# EAGLE design esp32_wroom_wearable (EAGLE 9.6.2)

## Sheet 1 of 3
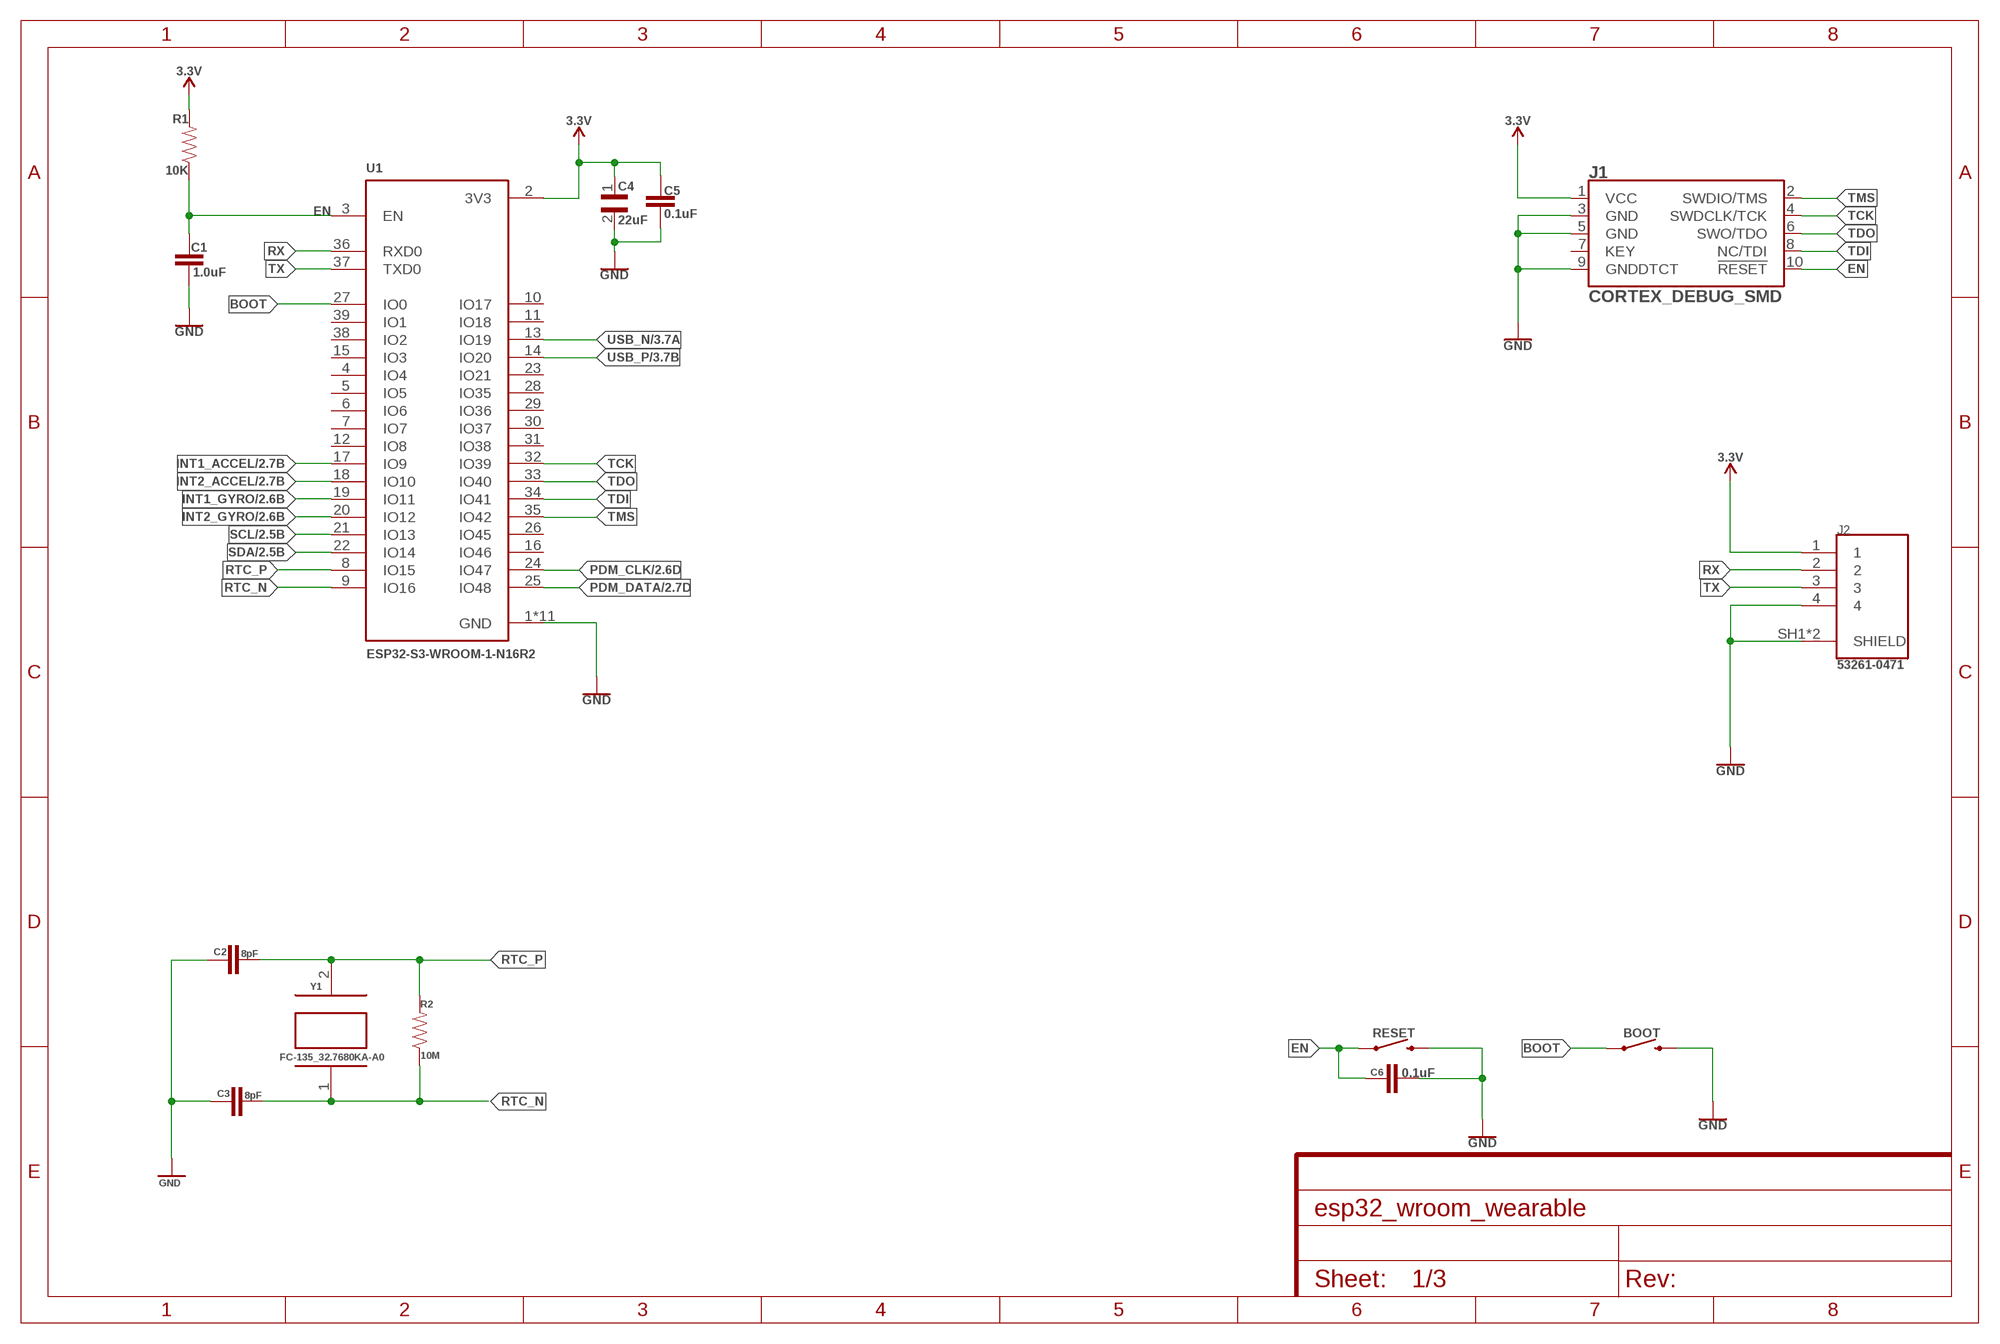
[diagram p0: schematic, sheet 1]

### Parts
BOOT  MOMENTARY-SWITCH-SPST-SMD-4.6X2.8MM  [TACTILE_SWITCH_SMD_4.6X2.8MM]
C1  1.0uF  1.0UF-0402-16V-10%  [0402]
C2  8pF  6PF-0402-50V-0.5%  [0402]
C3  8pF  6PF-0402-50V-0.5%  [0402]
C4  22uF  04026D226MAT2A  [CAPC1005X71N]
C5  0.1uF  0.1UF-0402-16V-10%  [0402]
C6  0.1uF  0.1UF-0402-16V-10%  [0402]
J1  CORTEX_DEBUG_SMD  [SAMTECH_FTSH-105-01]
J2  53261-0471  [MOLEX_53261-0471]
R1  10K  RESISTOR0402  [0402]
R2  10M  RESISTOR0402  [0402]
RESET  MOMENTARY-SWITCH-SPST-SMD-4.6X2.8MM  [TACTILE_SWITCH_SMD_4.6X2.8MM]
U1  ESP32-S3-WROOM-1-N16R2  [XCVR_ESP32-S3-WROOM-1-N16R2]
Y1  FC-135_32.7680KA-A0  [XTAL_FC-135_32.7680KA-A0]

### Nets
3.3V: C4.1 C5.1 J1.1(VCC) J2.1 R1.2 U1.2(3V3) ; also sheet 2,3
BOOT: BOOT.1 BOOT.2 U1.27(IO0)
EN: C1.1 C6.1 J1.10(!RESET) R1.1 RESET.1 RESET.2 U1.3(EN)
GND: BOOT.3 BOOT.4 C1.2 C2.1 C3.1 C4.2 C5.2 C6.2 J1.3(GND) J1.5(GND) J1.9(GNDDTCT) J2.4 J2.SH1(SHIELD) J2.SH2(SHIELD) RESET.3 RESET.4 U1.1(GND) U1.40(GND) U1.41_1(GND) U1.41_2(GND) U1.41_3(GND) U1.41_4(GND) U1.41_5(GND) U1.41_6(GND) U1.41_7(GND) U1.41_8(GND) U1.41_9(GND) ; also sheet 2,3
INT1_ACCEL: U1.17(IO9) ; also sheet 2
INT1_GYRO: U1.19(IO11) ; also sheet 2
INT2_ACCEL: U1.18(IO10) ; also sheet 2
INT2_GYRO: U1.20(IO12) ; also sheet 2
PDM_CLK: U1.24(IO47) ; also sheet 2
PDM_DATA: U1.25(IO48) ; also sheet 2
RTC_N: C3.2 R2.1 U1.9(IO16) Y1.1
RTC_P: C2.2 R2.2 U1.8(IO15) Y1.2
RX: J2.2 U1.36(RXD0)
SCL: U1.21(IO13) ; also sheet 2
SDA: U1.22(IO14) ; also sheet 2
TCK: J1.4(SWDCLK/TCK) U1.32(IO39)
TDI: J1.8(NC/TDI) U1.34(IO41)
TDO: J1.6(SWO/TDO) U1.33(IO40)
TMS: J1.2(SWDIO/TMS) U1.35(IO42)
TX: J2.3 U1.37(TXD0)
USB_N: U1.13(IO19) ; also sheet 3
USB_P: U1.14(IO20) ; also sheet 3
Unconnected: J1.7(KEY) U1.4(IO4) U1.5(IO5) U1.6(IO6) U1.7(IO7) U1.10(IO17) U1.11(IO18) U1.12(IO8) U1.15(IO3) U1.16(IO46) U1.23(IO21) U1.26(IO45) U1.28(IO35) U1.29(IO36) U1.30(IO37) U1.31(IO38) U1.38(IO2) U1.39(IO1)

## Sheet 2 of 3
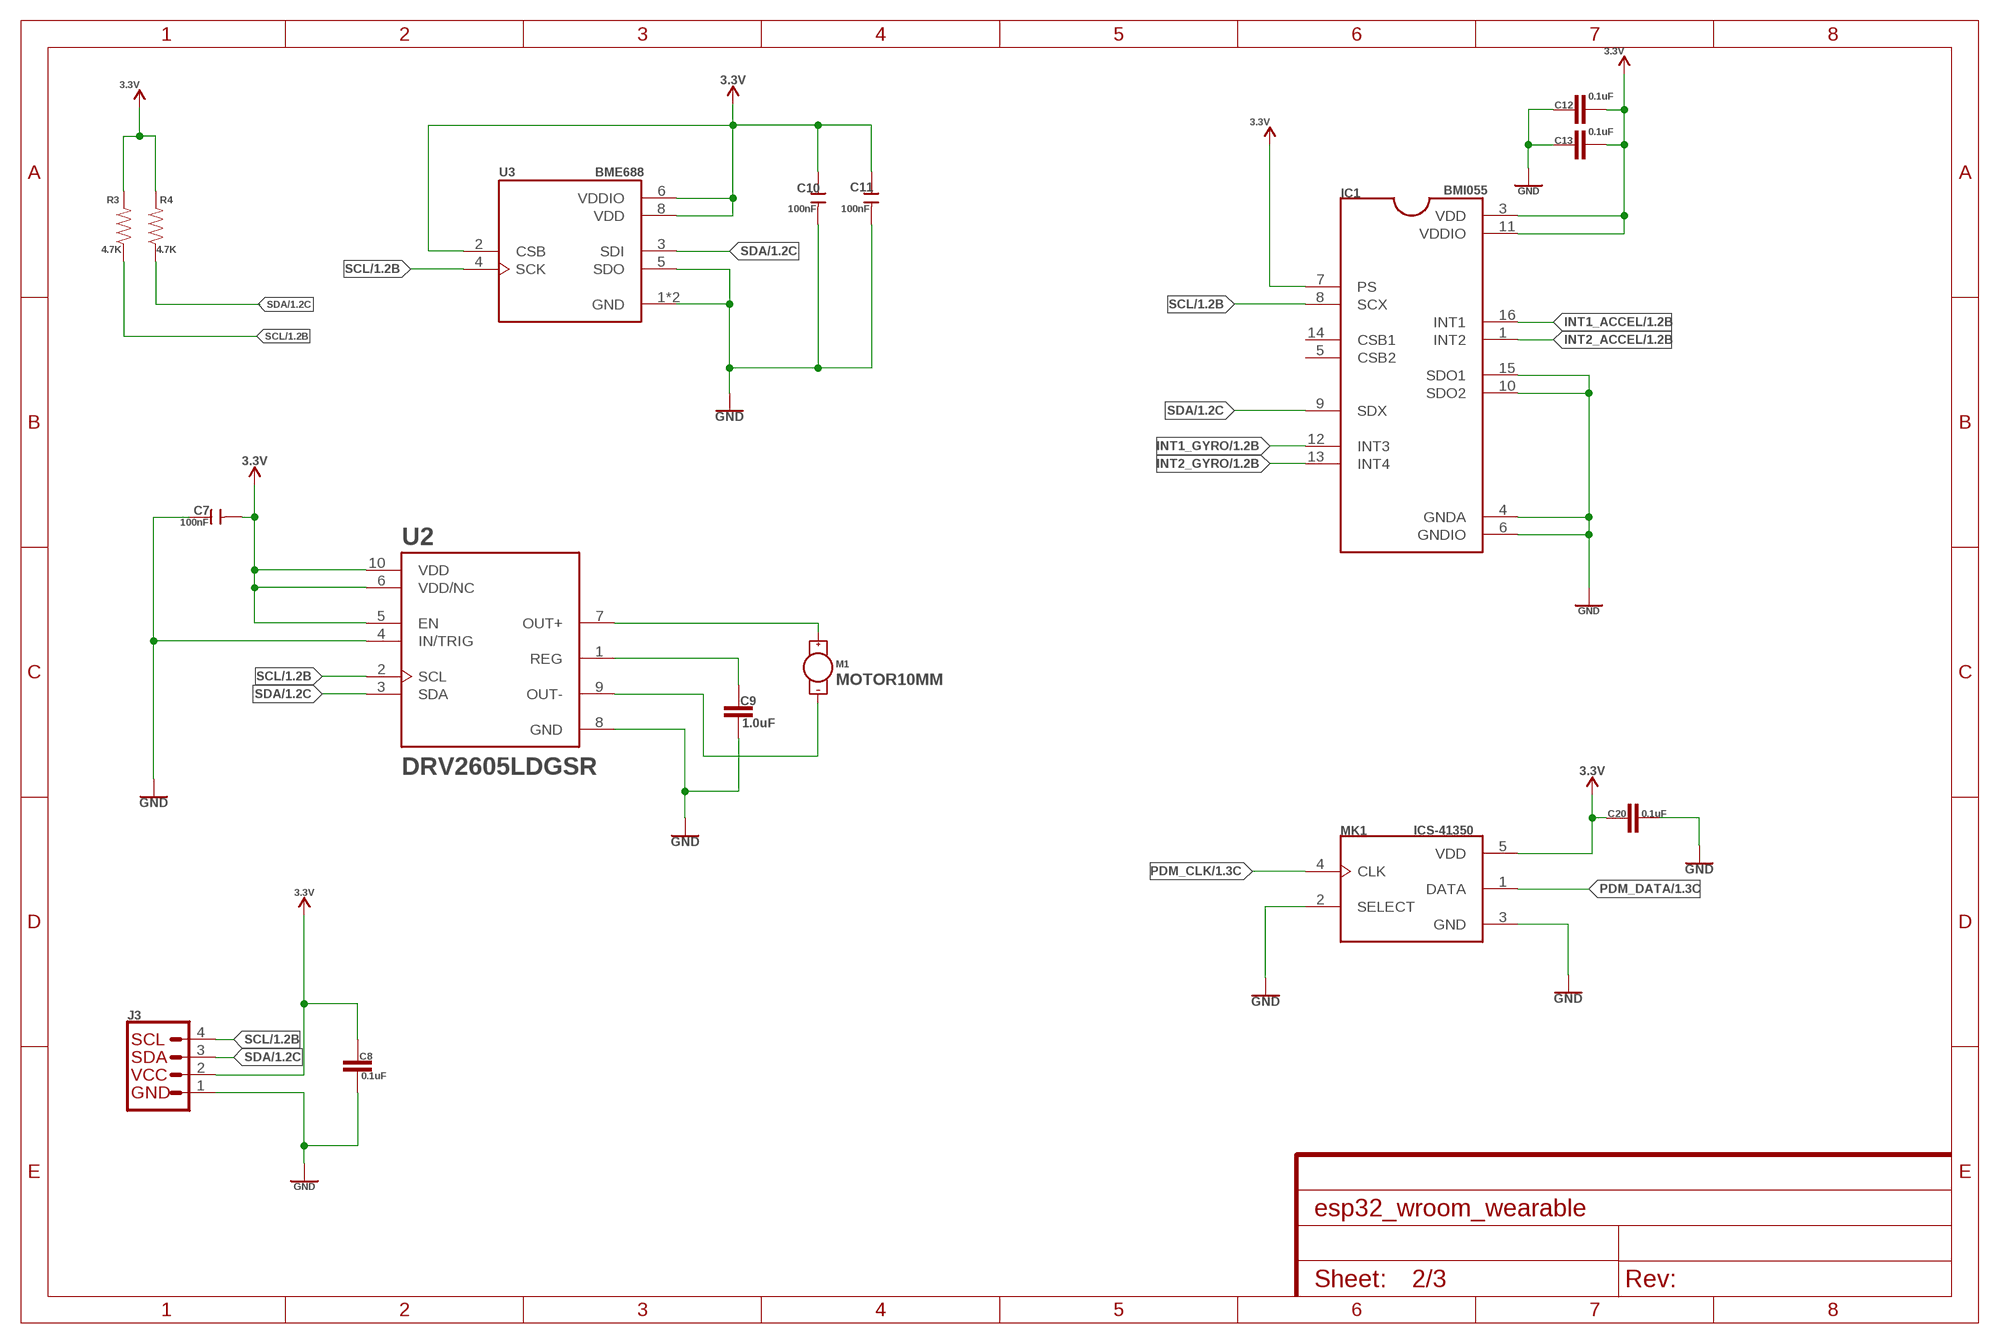
[diagram p1: schematic, sheet 2]

### Parts
C7  100nF  CERAMIC-100NF-25V-10%-X7R(0402)  [C0402]
C8  0.1uF  0.1UF-0402-16V-10%  [0402]
C9  1.0uF  1.0UF-0402-16V-10%  [0402]
C10  100nF  CERAMIC-100NF-25V-10%-X7R(0402)  [C0402]
C11  100nF  CERAMIC-100NF-25V-10%-X7R(0402)  [C0402]
C12  0.1uF  0.1UF-0402-16V-10%  [0402]
C13  0.1uF  0.1UF-0402-16V-10%  [0402]
C20  0.1uF  0.1UF-0402-16V-10%  [0402]
IC1  BMI055  [QFN50P300X450X100-16N]
J3  QWIIC_CONNECTORJS-1MM  [1X04_1MM_RA]
M1  MOTOR10MM  [VIBE-MOTOR-10MM]
MK1  ICS-41350  [MIC_ICS-41350]
R3  4.7K  RESISTOR0402  [0402]
R4  4.7K  RESISTOR0402  [0402]
U2  DRV2605LDGSR  [SOP50P490X110-10N]
U3  BME688  [IC_BME688]

### Nets
3.3V: C7.2 C8.1 C10.1 C11.1 C12.2 C13.2 C20.1 IC1.3(VDD) IC1.7(PS) IC1.11(VDDIO) J3.2 MK1.5(VDD) R3.2 R4.2 U2.5(EN) U2.6(VDD/NC) U2.10(VDD) U3.2(CSB) U3.6(VDDIO) U3.8(VDD) ; also sheet 1,3
GND: C7.1 C8.2 C9.2 C10.2 C11.2 C12.1 C13.1 C20.2 IC1.4(GNDA) IC1.6(GNDIO) IC1.10(SDO2) IC1.15(SDO1) J3.1 MK1.2(SELECT) MK1.3(GND) U2.4(IN/TRIG) U2.8(GND) U3.1(GND) U3.5(SDO) U3.7(GND) ; also sheet 1,3
INT1_ACCEL: IC1.16(INT1) ; also sheet 1
INT1_GYRO: IC1.12(INT3) ; also sheet 1
INT2_ACCEL: IC1.1(INT2) ; also sheet 1
INT2_GYRO: IC1.13(INT4) ; also sheet 1
N$6: C9.1 U2.1(REG)
N$10: M1.+ U2.7(OUT+)
N$11: M1.- U2.9(OUT-)
PDM_CLK: MK1.4(CLK) ; also sheet 1
PDM_DATA: MK1.1(DATA) ; also sheet 1
SCL: IC1.8(SCX) J3.4 R3.1 U2.2(SCL) U3.4(SCK) ; also sheet 1
SDA: IC1.9(SDX) J3.3 R4.1 U2.3(SDA) U3.3(SDI) ; also sheet 1
Unconnected: IC1.5(CSB2) IC1.14(CSB1)

## Sheet 3 of 3
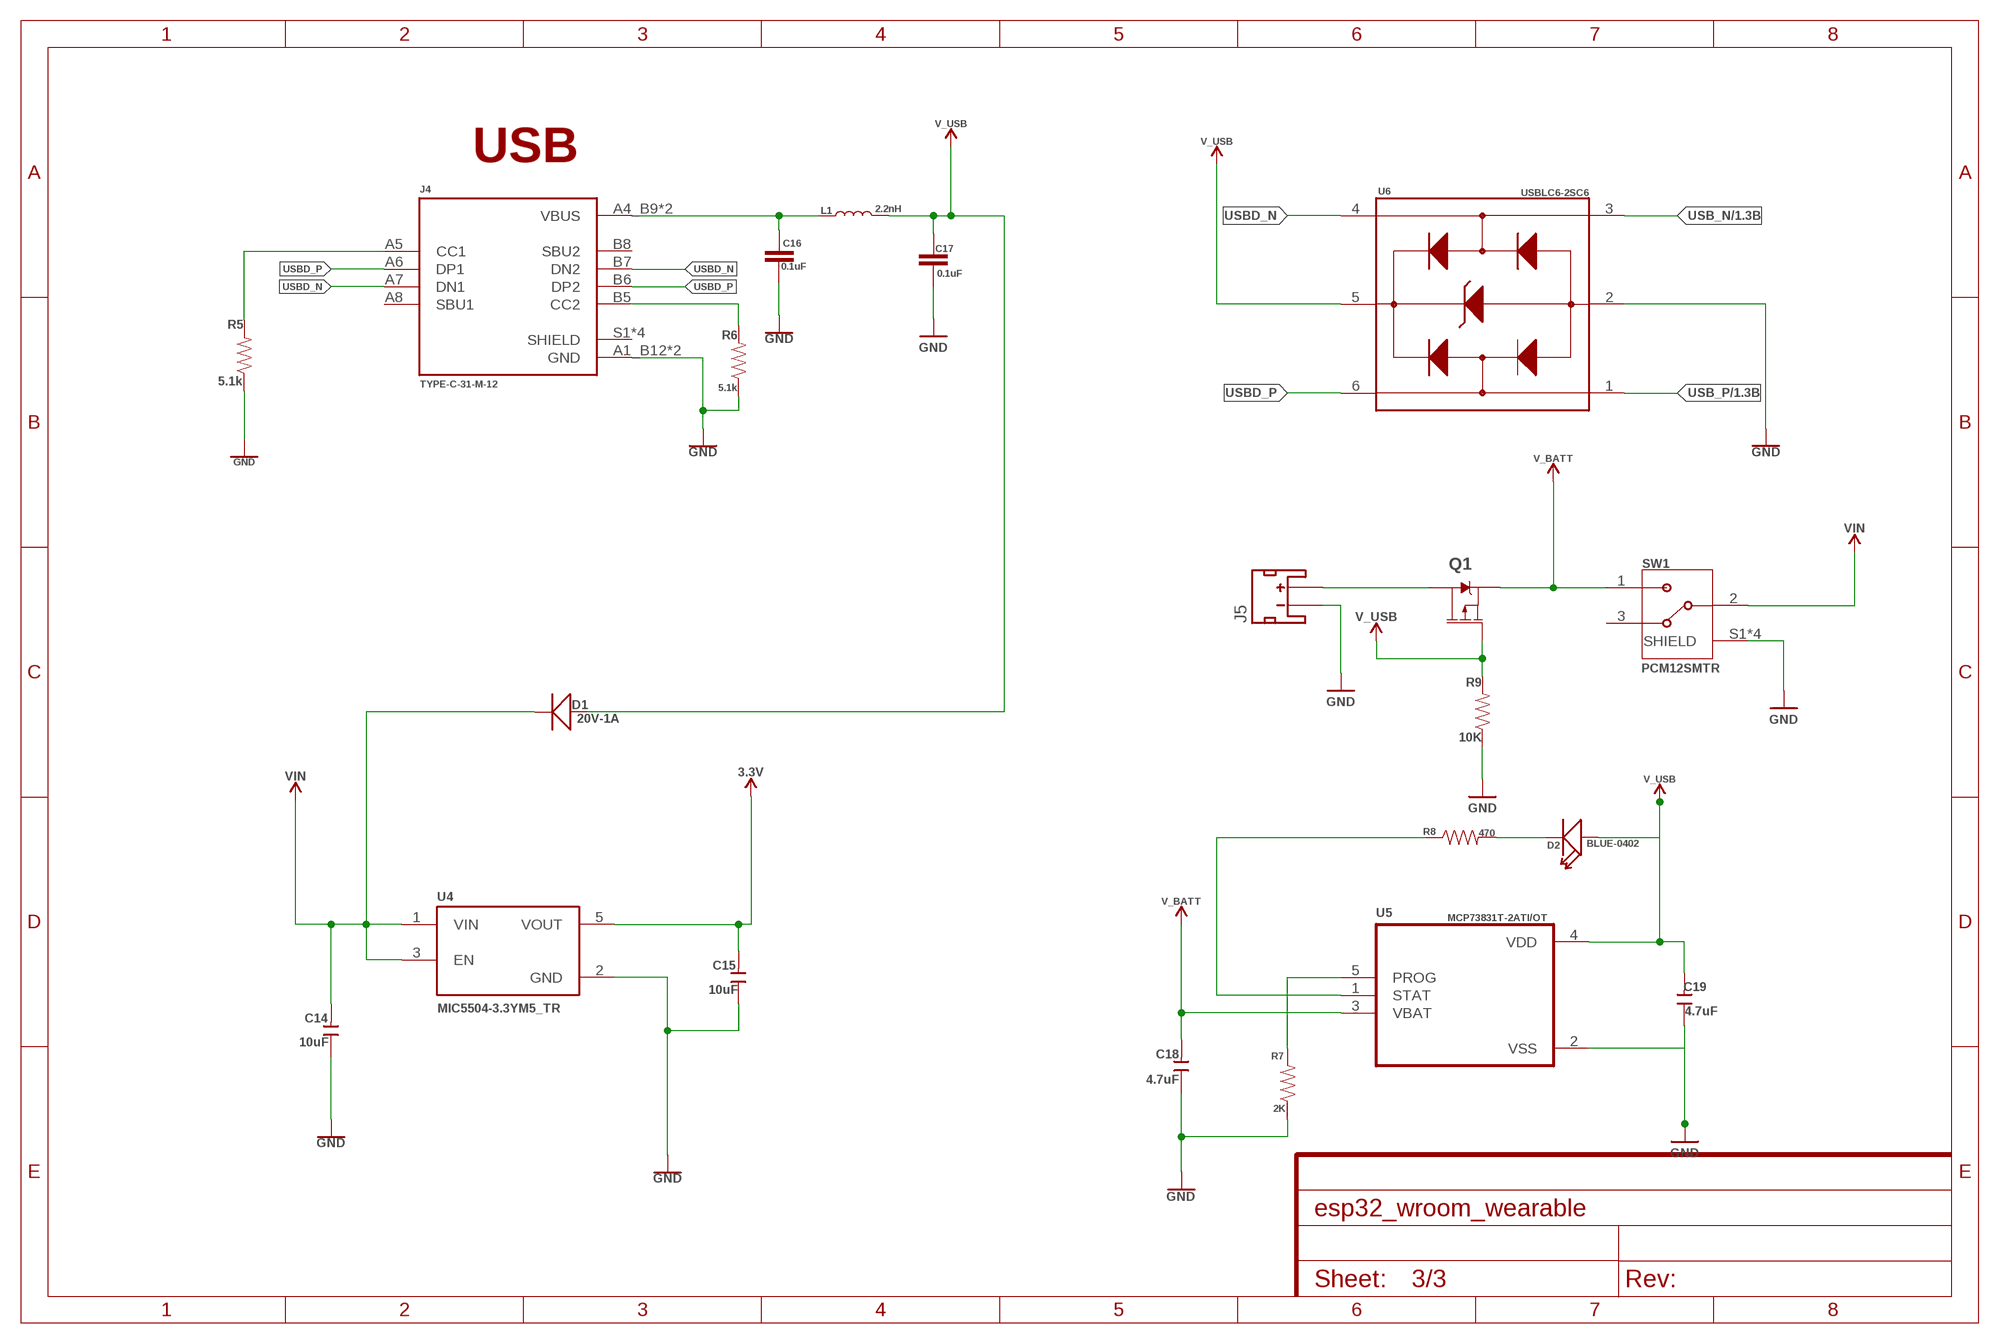
[diagram p2: schematic, sheet 3]

### Parts
C14  10uF  CERAMIC-10UF-6.3V-20%-X5R(0402)  [C0402]
C15  10uF  CERAMIC-10UF-6.3V-20%-X5R(0402)  [C0402]
C16  0.1uF  0.1UF-0402-16V-10%  [0402]
C17  0.1uF  0.1UF-0402-16V-10%  [0402]
C18  4.7uF  CERAMIC-4.7UF-6.3V-20%-X5R(0402)  [C0402]
C19  4.7uF  CERAMIC-4.7UF-6.3V-20%-X5R(0402)  [C0402]
D1  20V-1A  SMD-DIODE-SCHOTTKY-20V-1A(SOD-123)  [SOD-123]
D2  BLUE-0402  SMD-LED-CLEAR-BLUE(0402)  [LED-0402]
J4  TYPE-C-31-M-12  [HRO_TYPE-C-31-M-12]
J5  JST_2MM_MALE  [JST-2-SMD]
L1  2.2nH  INDUCTOR-0402-3.9NH  [0402]
Q1  2.5A/30V/105mΩ  MOSFET_PCH-DMG2307L  [SOT23-3]
R5  5.1k  5.6KOHM-0603-1/10W-1%  [0603]
R6  5.1k  5.6KOHM-0603-1/10W-1%  [0603]
R7  2K  RESISTOR0402  [0402]
R8  470  RESISTOR0402  [0402]
R9  10K  RESISTOR0402  [0402]
SW1  PCM12SMTR  [SW_PCM12SMTR]
U4  MIC5504-3.3YM5_TR  [SOT95P280X145-5N]
U5  MCP73831T-2ATI/OT  [SOT95P280X145-5N]
U6  USBLC6-2SC6  [SOT95P280X145-6N]

### Nets
3.3V: C15.2 U4.5(VOUT) ; also sheet 1,2
GND: C14.1 C15.1 C16.2 C17.2 C18.1 C19.1 J4.A1_B12(GND) J4.B1_A12(GND) J5.1(-) R5.1 R6.1 R7.1 R9.1 SW1.S1(SHIELD) SW1.S2(SHIELD) SW1.S3(SHIELD) SW1.S4(SHIELD) U4.2(GND) U5.2(VSS) U6.2(GND) ; also sheet 1,2
N$1: J4.A5(CC1) R5.2
N$2: J4.B5(CC2) R6.2
N$3: J5.2(+) Q1.3(D)
N$12: D2.- R8.2
N$13: R8.1 U5.1(STAT)
N$14: C16.1 J4.A4_B9(VBUS) J4.B4_A9(VBUS) L1.1
N$15: R7.2 U5.5(PROG)
USB_N: U6.3(I/O2_IN) ; also sheet 1
USB_P: U6.1(I/O1_IN) ; also sheet 1
USBD_N: J4.A7(DN1) J4.B7(DN2) U6.4(I/O2_OUT)
USBD_P: J4.A6(DP1) J4.B6(DP2) U6.6(I/O1_OUT)
V_BATT: C18.2 Q1.2(S) SW1.1 U5.3(VBAT)
V_USB: C17.1 C19.2 D1.+ D2.+ L1.2 Q1.1(G) R9.2 U5.4(VDD) U6.5(VBUS)
VIN: C14.2 D1.- SW1.2 U4.1(VIN) U4.3(EN)
Unconnected: J4.A8(SBU1) J4.B8(SBU2) J4.S1(SHIELD) J4.S2(SHIELD) J4.S3(SHIELD) J4.S4(SHIELD) J5.NC1(PAD1) J5.NC2(PAD2) SW1.3

### Notes on the sheet
- USB

## Library data of the parts
BOOT RESET = SparkFun-Switches:MOMENTARY-SWITCH-SPST: Momentary Switch (Pushbutton) - SPST Normally-open (NO) SPST momentary switches (buttons, pushbuttons). Variants PTH-12MM - 12mm square, through-hole Momentary Pushbutton Switch - 12mm Square <https://www.sparkfun.com/products/9190> (COM-09190) PTH-6.0MM, PTH-6.0MM-KIT - 6.0mm square, through-hole Mini Pushbutton Switch <https://www.sparkfun.com/products/97> (COM-00097) KIT package intended for soldering kit's - only one side of pads' copper is exposed. PTH-RIGHT-ANGLE-KIT - Right-angle, through-hole Right Angle Tactile Button <https://www.sparkfun.com/products/10791> - Used on SparkFun BigTime Watch Kit <https://www.sparkfun.com/products/11734> SMD-12MM - 12mm square, surface-mount Tactile Button - SMD (12mm) <https://www.sparkfun.com/products/12993> (COM-12993) Used on SparkFun PicoBoard <https://www.sparkfun.com/products/11888> SMD-4.5MM - 4.5mm Square Trackball Switch Used on SparkFun Blackberry Trackballer Breakout <https://www.sparkfun.com/products/13169> SMD-4.6MMX2.8MM - 4.60mm x 2.80mm, surface mount Used on SparkFun SAMD21 Mini Breakout <https://www.sparkfun.com/products/13664> SMD-5.2MM, SMD-5.2-REDUNDANT - 5.2mm square, surface-mount Mini Pushbutton Switch - SMD <https://www.sparkfun.com/products/8720> (COM-08720) Used on Arduino Pro Mini <https://www.sparkfun.com/products/11114> REDUNDANT package connects both switch circuits together SMD-6.0X3.5MM - 6.0 x 3.5mm, surface mount Momentary Reset Switch SMD <https://www.sparkfun.com/products/8229> (COM-08229) SMD-6.2MM-TALL - 6.2mm square, surface mount Tactile Button - SMD (6mm) <https://www.sparkfun.com/products/12992> Used on SparkFun Digital Sandbox <https://www.sparkfun.com/products/12651> SMD-RIGHT-ANGLE - Right-angle, surface mount Used on SparkFun Block for Intel® Edison - Arduino <https://www.sparkfun.com/products/13036>; PROD_ID: SWCH-13065
C1 C9 = SparkFun-Capacitors:1.0UF: 1µF ceramic capacitors A capacitor is a passive two-terminal electrical component used to store electrical energy temporarily in an electric field.; PROD_ID: CAP-12417
C2 C3 = SparkFun-Capacitors:6PF: 6pF ceramic capacitors A capacitor is a passive two-terminal electrical component used to store electrical energy temporarily in an electric field.; PROD_ID: CAP-13455; VALUE: 6pF
C4 = 04026D226MAT2A:04026D226MAT2A: 22UF 6.3V 20% 0402 Check availability <https://pricing.snapeda.com/parts/04026D226MAT2A/AVX/view-part?ref=eda>; AVAILABILITY: In Stock; DESCRIPTION: 22 µF ±20% 6.3V Ceramic Capacitor X5R 0402 (1005 Metric); MF: AVX; MP: 04026D226MAT2A; PACKAGE: 1005 AVX; PRICE: None
C5 C6 C8 C12 C13 C16 C17 C20 = SparkFun-Capacitors:0.1UF: 0.1µF ceramic capacitors A capacitor is a passive two-terminal electrical component used to store electrical energy temporarily in an electric field.; PROD_ID: CAP-12416
C7 C10 C11 = OPL_Capacitor:CERAMIC-100NF-25V-10%-X7R(0402): 302010024; MPN: CC0402KRX7R8BB104; VALUE: 100nf
C14 C15 = OPL_Capacitor:CERAMIC-10UF-6.3V-20%-X5R(0402): 302010053; MPN: CC0402MRX5R5BB106; VALUE: 10uf
C18 C19 = OPL_Capacitor:CERAMIC-4.7UF-6.3V-20%-X5R(0402): 302010019; MPN: CC0402MRX5R5BB475; VALUE: 4.7uf
D1 = OPL_Discrete_Semiconductor:SMD-DIODE-SCHOTTKY-20V-1A(SOD-123): 304020034; MPN: B5819W
D2 = OPL_Optoelectronics:SMD-LED-CLEAR-BLUE(0402): 304090075; MPN: BL-HB337A-AV-TRB
IC1 = BMI055:BMI055: BMI055 6 Axis Inertial Sensor (12 Bit Acceleration Sensor + Gyroscope) 3 x 4 mm Check availability <https://pricing.snapeda.com/parts/BMI055/Bosch/view-part?ref=eda>; AVAILABILITY: In Stock; DESCRIPTION: BMI055 series Accelerometer, Gyroscope, 6 Axis Sensor Evaluation Board; MF: Bosch; MP: BMI055; PACKAGE: LGA-16 Bosch; PRICE: None; PURCHASE-URL: https://pricing.snapeda.com/search/part/BMI055/?ref=eda
J1 = SparkFun-Connectors:CORTEX_DEBUG: Cortex Debug Connector - 10 pin Supports JTAG debug, Serial Wire debug, and Serial Wire Viewer. PTH and SMD connector options available. General Connector Information <http://infocenter.arm.com/help/topic/com.arm.doc.faqs/attached/13634/cortex_debug_connectors.pdf> Products: PTH Connector <http://www.digikey.com/product-detail/en/cnc-tech/3220-10-0100-00/1175-1627-ND/3883661> -via Digi-Key SparkFun PSoc <https://www.sparkfun.com/products/13229> SparkFun T <https://www.sparkfun.com/products/13810>
J2 = 53261-0471:53261-0471: Header Molex 1.25mm Pitch PicoBlade™ Header, Surface Mount, Right Angle, 4 Circuits Check availability <https://pricing.snapeda.com/parts/53261-0471/Molex/view-part?ref=eda>; AVAILABILITY: In Stock; DESCRIPTION: Connector Header Surface Mount, Right Angle 4 position 0.049 (1.25mm); MF: Molex; MP: 53261-0471; PACKAGE: None; PRICE: None; PURCHASE-URL: https://pricing.snapeda.com/search/part/53261-0471/?ref=eda
J3 = SparkFun-Connectors:QWIIC_CONNECTOR: SparkFun I2C Standard Qwiic Connector An SMD 1mm pitch JST connector makes it easy and quick (get it? Qwiic?) to connect I2C devices to each other. The Qwiic system <http://www.sparkfun.com/qwiic> enables fast and solderless connection between popular platforms and various sensors and actuators. We carry 200mm <https://www.sparkfun.com/products/14204>, 100mm <https://www.sparkfun.com/products/14205>, 50mm <https://www.sparkfun.com/products/14206>, and breadboard friendly <https://www.sparkfun.com/products/14207> Qwiic cables. We also offer 10 pcs strips <https://www.sparkfun.com/products/14323> the SMD connectors.; PROD_ID: CONN-13694
J4 = TYPE-C-31-M-12:TYPE-C-31-M-12: Check availability <https://pricing.snapeda.com/parts/TYPE-C-31-M-12/HRO%20Electronics%20Co.%2C%20Ltd./view-part?ref=eda>; AVAILABILITY: Not in stock; DESCRIPTION: USB Connectors 24 Receptacle 1 8.94*7.3mm RoHS; MF: HRO Electronics Co., Ltd.; MP: TYPE-C-31-M-12; PACKAGE: Package; PRICE: None
J5 = SparkFun-Connectors:JST_2MM_MALE: JST 2MM MALE RA CONNECTOR Two pin, compact surface mount connector. Commonly used as a battery input connection point. We really like the solid locking feeling and high current rating on these small connectors. We use these all the time as battery connectors. Mates to single-cell LiPo batteries. Here is the connector we sell at SparkFun: JST Right Angle Connector - White <https://www.sparkfun.com/products/8612> (PRT-08612) Datasheet <http://www.sparkfun.com/datasheets/Prototyping/Connectors/JST-Horizontal.pdf> It was used on these SparkFun products: SparkFun MOSFET Power Controller <https://www.sparkfun.com/products/11214> (PRT-11214) SparkFun Battery Babysitter - LiPo Battery Manager <https://www.sparkfun.com/products/13777> (PRT-13777) And many, many others that required a lipo battery connection.; PROD_ID: CONN-11443; SF_ID: PRT-08612
L1 = SparkFun-Coils:INDUCTOR: Inductors Resist changes in electrical current. Basically a coil of wire. SparkFun Products: SparkFun Load Cell Amplifier - HX711 <https://www.sparkfun.com/products/13879> IOIO-OTG - V2.2 <https://www.sparkfun.com/products/13613>; PROD_ID: NDUC-13457; VALUE: 3.9NH
M1 = SparkFun-Electromechanical:MOTOR: Motor (Single-Phase) Two-terminal, single-phase motors. SparkFun Products Vibration Motor <https://www.sparkfun.com/products/8449> (ROB-08449) Physical dimension and wire connections for this powerful vibration motor. Motor has a self adhesive backing.; PROD_ID: COMP-08572; SF_SKU: ROB-08449
MK1 = ICS-41350:ICS-41350: Bottom Port PDM Low Power muti-Mode Microphone with high AOP Mode Check availability <https://pricing.snapeda.com/parts/ICS-41350/TDK%20InvenSense/view-part?ref=eda>; AVAILABILITY: In Stock; DESCRIPTION: 50 Hz ~ 40 kHz Digital, PDM Microphone MEMS (Silicon) 1.65 V ~ 3.63 V Omnidirectional (-32dB ±1dB) Solder Pads; MF: TDK InvenSense; MP: ICS-41350; PACKAGE: None; PRICE: None; PURCHASE-URL: https://pricing.snapeda.com/search/part/ICS-41350/?ref=eda
Q1 = SparkFun-DiscreteSemi:MOSFET_PCH: P-channel MOSFETs Voltage controlled devices that allow control of high current outputs. SparkFun Products: SparkFun ESP32 Thing <https://www.sparkfun.com/products/13907> SparkFun ESP8266 Thing <https://www.sparkfun.com/products/13231>; PROD_ID: TRANS-11308
R1-R4 R7-R9 = SparkFun-Resistors:RESISTOR: Generic Resistor Package
R5 R6 = SparkFun-Resistors:5.6KOHM: 5.6kΩ resistor A resistor is a passive two-terminal electrical component that implements electrical resistance as a circuit element. Resistors act to reduce current flow, and, at the same time, act to lower voltage levels within circuits. - Wikipedia; PROD_ID: RES-12378; VALUE: 5.6k
SW1 = PCM12SMTR:PCM12SMTR: Switch Slide ON ON SPDT Side Slide 0.3A 6VDC 10000Cycles Gull Wing SMD T/R Check availability <https://pricing.snapeda.com/parts/PCM12SMTR/C%26K/view-part?ref=eda>; AVAILABILITY: In Stock; DESCRIPTION: Slide Switch SPDT Surface Mount, Right Angle; MF: C&K; MP: PCM12SMTR; PACKAGE: None; PRICE: None; PURCHASE-URL: https://pricing.snapeda.com/search/part/PCM12SMTR/?ref=eda
U1 = ESP32-S3-WROOM-1-N16R2:ESP32-S3-WROOM-1-N16R2: Check availability <https://pricing.snapeda.com/parts/ESP32-S3-WROOM-1-N16R2/Espressif%20Systems/view-part?ref=eda>; AVAILABILITY: In Stock; DESCRIPTION: Bluetooth, WiFi 802.11b/g/n, Bluetooth v5.0 Transceiver Module 2.4GHz PCB Trace Surface Mount; MF: Espressif Systems; MP: ESP32-S3-WROOM-1-N16R2; PACKAGE: None; PRICE: None; PURCHASE-URL: https://pricing.snapeda.com/search/part/ESP32-S3-WROOM-1-N16R2/?ref=eda
U2 = DRV2605LDGSR:DRV2605LDGSR: Haptic Driver for ERM and LRA with Built-In Library and Smart Loop Architecture 10-VSSOP -40 to 85 Check availability <https://pricing.snapeda.com/parts/DRV2605LDGSR/Texas%20Instruments/view-part?ref=eda>; AVAILABILITY: In Stock; DESCRIPTION: Haptic driver for ERM/LRA with 2-V operation, waveform library & auto-resonance tracking; MF: Texas Instruments; MP: DRV2605LDGSR; PACKAGE: VSSOP-10 Texas Instruments; PRICE: None; PURCHASE-URL: https://pricing.snapeda.com/search/part/DRV2605LDGSR/?ref=eda
U3 = BME688:BME688: Gas sensor measuring relative humidity, barometric pressure, ambient temperature and gas (VOC) Check availability <https://pricing.snapeda.com/parts/BME688/Bosch%20Sensortec/view-part?ref=eda>; AVAILABILITY: In Stock; DESCRIPTION: Gas sensor measuring relative humidity, barometric pressure, ambient temperature and gas (VOC); MF: Bosch Sensortec; MP: BME688; PACKAGE: None; PRICE: None; PURCHASE-URL: https://pricing.snapeda.com/search/part/BME688/?ref=eda
U4 = MIC5504-3.3YM5_TR:MIC5504-3.3YM5_TR: Linear Voltage Regulator IC 1 Output 300mA SOT-23-5 Check availability <https://pricing.snapeda.com/parts/MIC5504-3.3YM5%20TR/Microchip/view-part?ref=eda>; AVAILABILITY: In Stock; DESCRIPTION: Linear Voltage Regulator IC Positive Fixed 1 Output 300mA SOT-23-5; MF: Microchip; MP: MIC5504-3.3YM5 TR; PACKAGE: SOT-23 Microchip; PRICE: None; PURCHASE-URL: https://pricing.snapeda.com/search/part/MIC5504-3.3YM5 TR/?ref=eda
U5 = MCP73831T-2ATI_OT:MCP73831T-2ATI/OT: Check availability <https://pricing.snapeda.com/parts/MCP73831T-2ATI/OT/Microchip/view-part?ref=eda>; AVAILABILITY: In Stock; DESCRIPTION: Charger IC Lithium Ion/Polymer SOT-23-5; MF: Microchip; MP: MCP73831T-2ATI/OT; PACKAGE: SOT-23 Microchip; PRICE: None; PURCHASE-URL: https://pricing.snapeda.com/search/part/MCP73831T-2ATI/OT/?ref=eda
U6 = USBLC6-2SC6:USBLC6-2SC6: Check availability <https://pricing.snapeda.com/parts/USBLC6-2SC6/STMicroelectronics/view-part?ref=eda> Check availability <https://pricing.snapeda.com/parts/USBLC6-2SC6/STMicroelectronics/view-part?ref=eda> Check availability <https://pricing.snapeda.com/parts/USBLC6-2SC6/STMicroelectronics/view-part?ref=eda>; AVAILABILITY: In Stock; DESCRIPTION: 17V Clamp 5A (8/20µs) Ipp Tvs Diode Surface Mount SOT-23-6; MF: STMicroelectronics; MP: USBLC6-2SC6; PACKAGE: SOT-23-6 STMicroelectronics; PRICE: None; PURCHASE-URL: https://pricing.snapeda.com/search/part/USBLC6-2SC6/?ref=eda
Y1 = FC-135_32.7680KA-A0:FC-135_32.7680KA-A0: None Check availability <https://pricing.snapeda.com/parts/FC-135%2032.7680KA-A0/EPSON/view-part?ref=eda>; AVAILABILITY: In Stock; DESCRIPTION: 32.768 kHz ±20ppm Crystal 12.5pF 70 kOhms 2-SMD, No Lead; MF: EPSON; MP: FC-135 32.7680KA-A0; PACKAGE: SMD-2 Epson; PRICE: None; PURCHASE-URL: https://pricing.snapeda.com/search/part/FC-135 32.7680KA-A0/?ref=eda

## Board
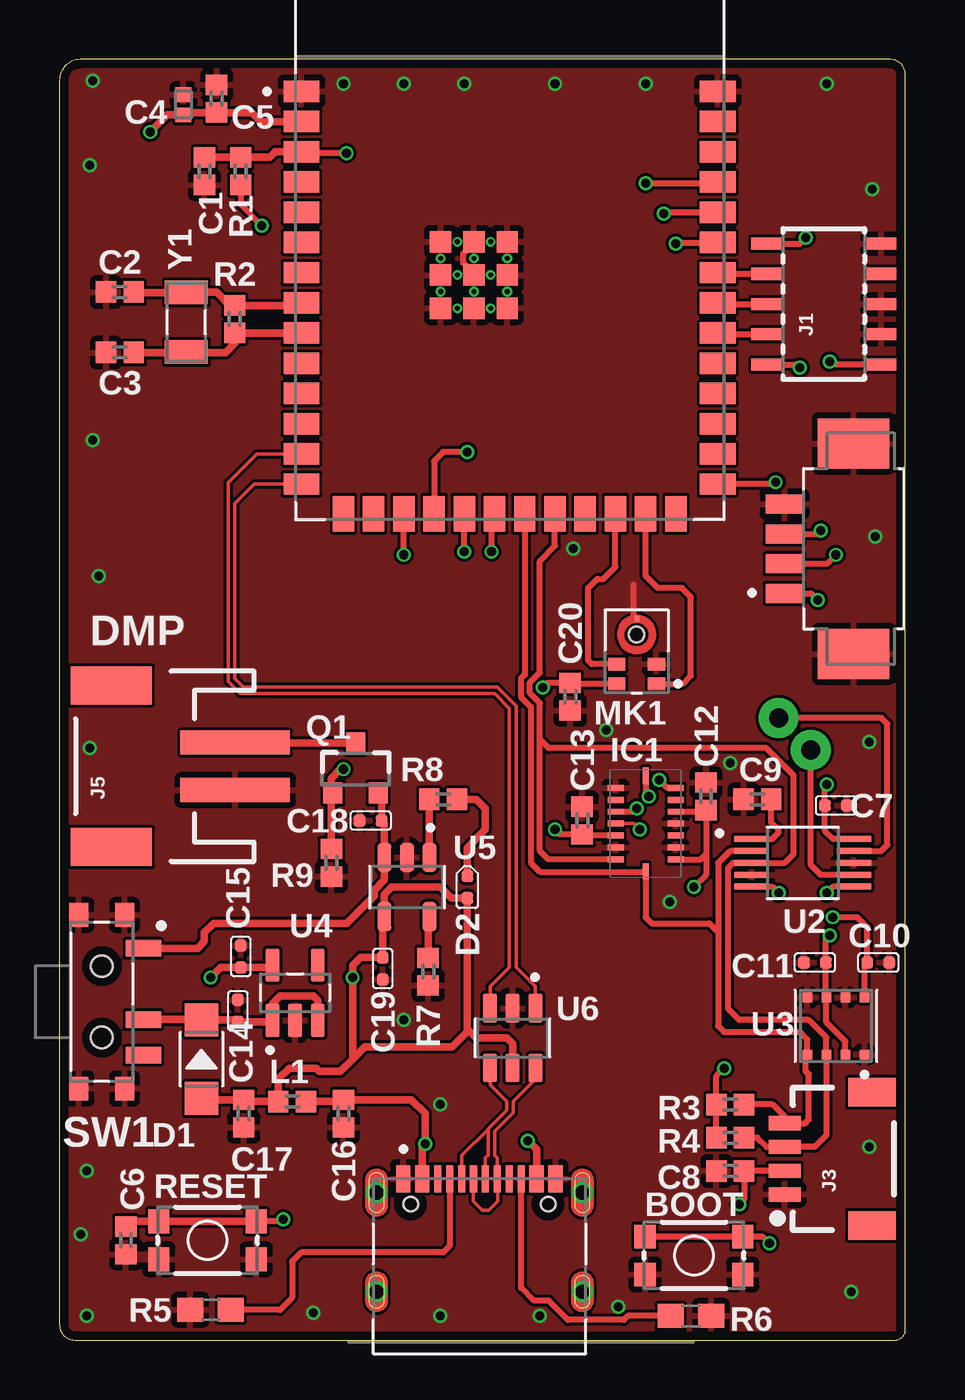
[diagram p3: board, top side]
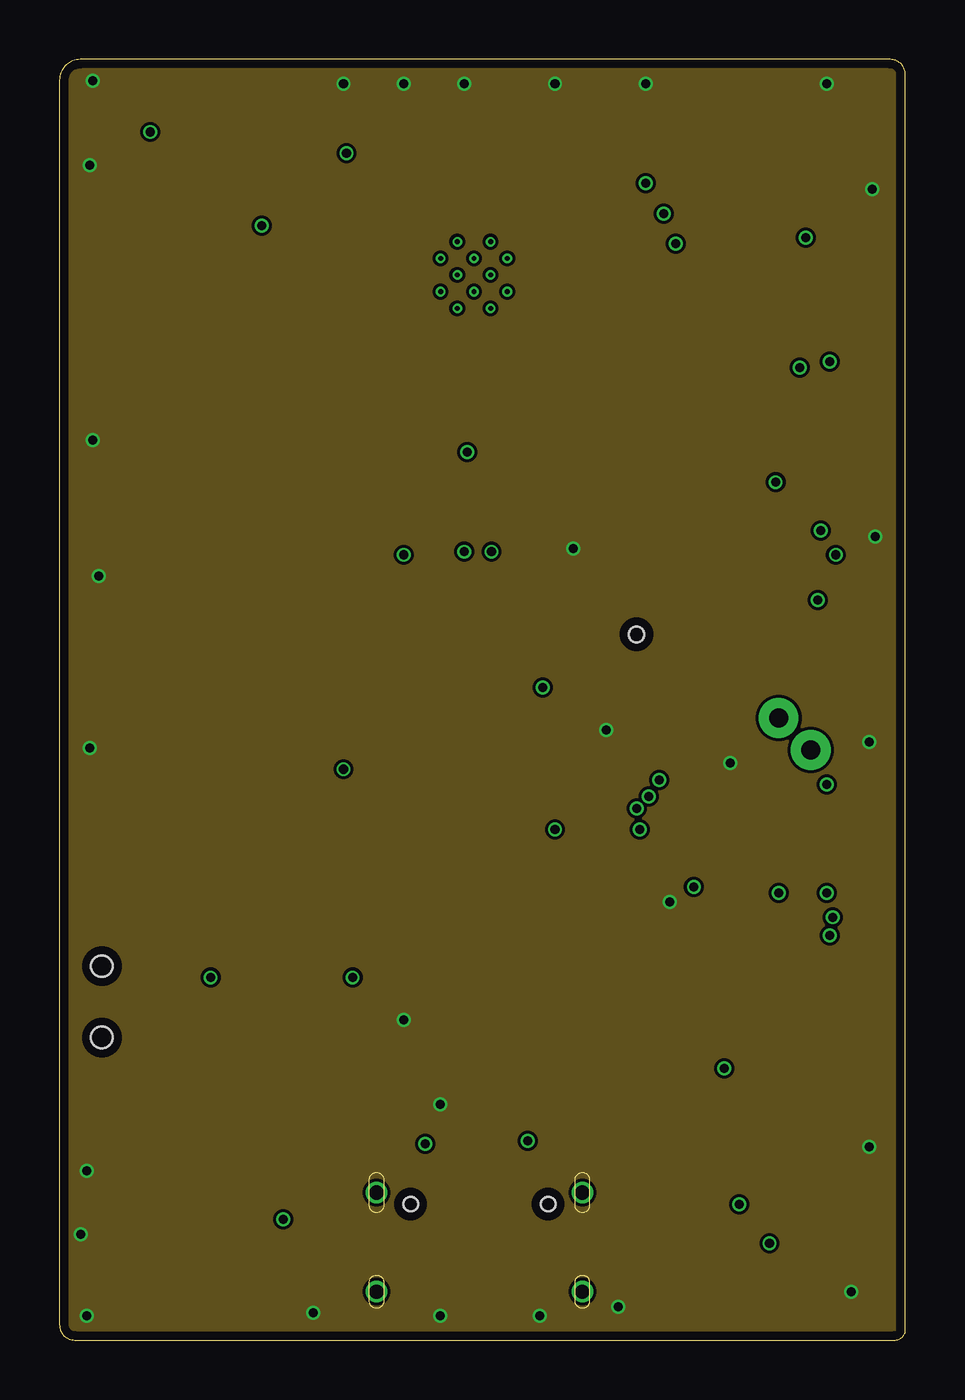
[diagram p4: board, inner layer Route2]
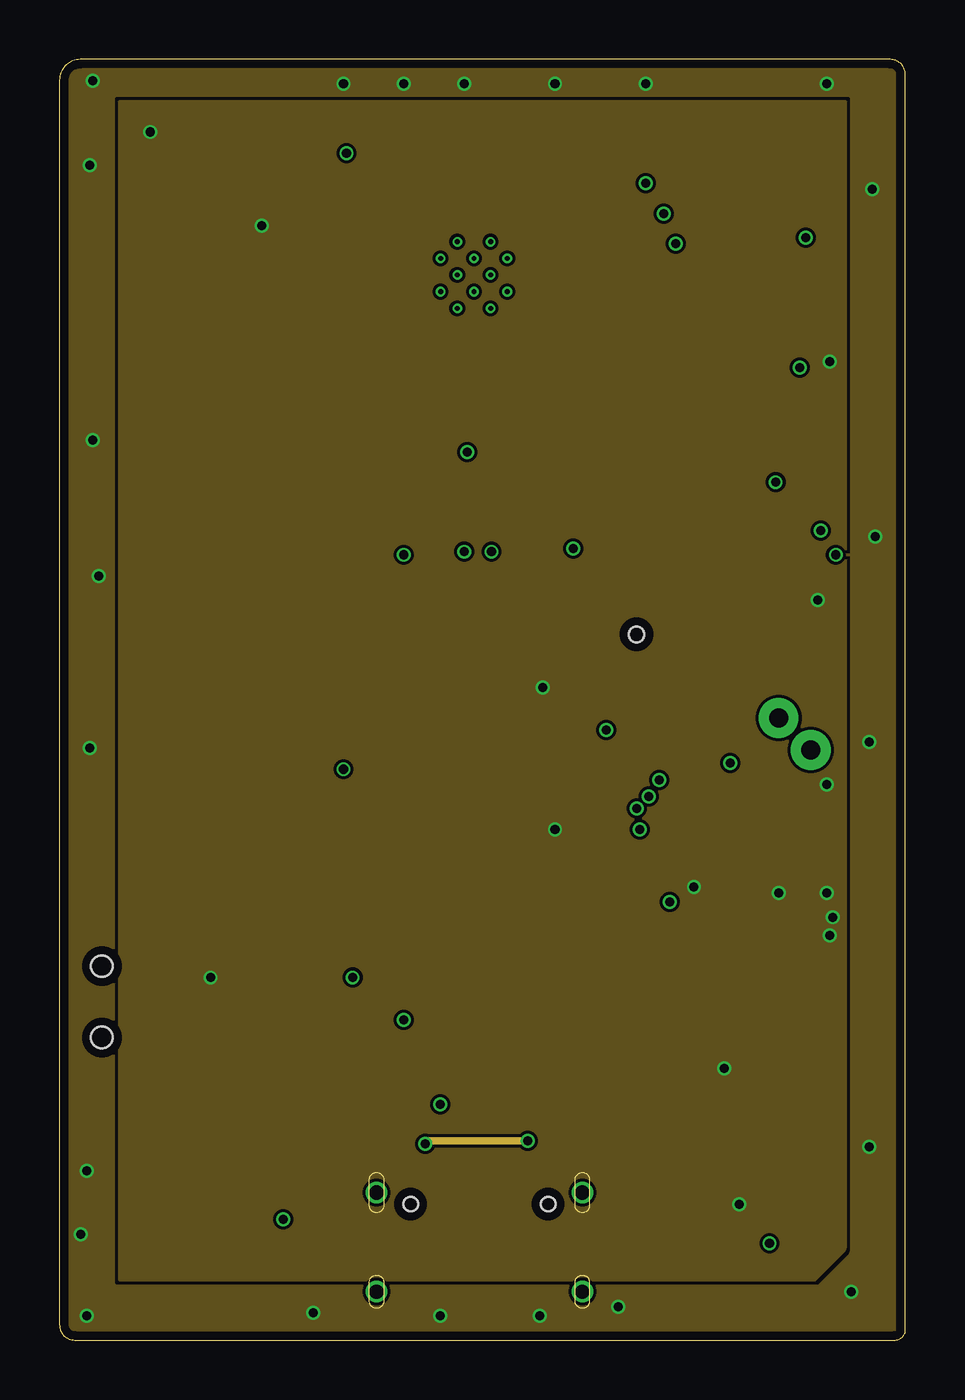
[diagram p5: board, inner layer Route15]
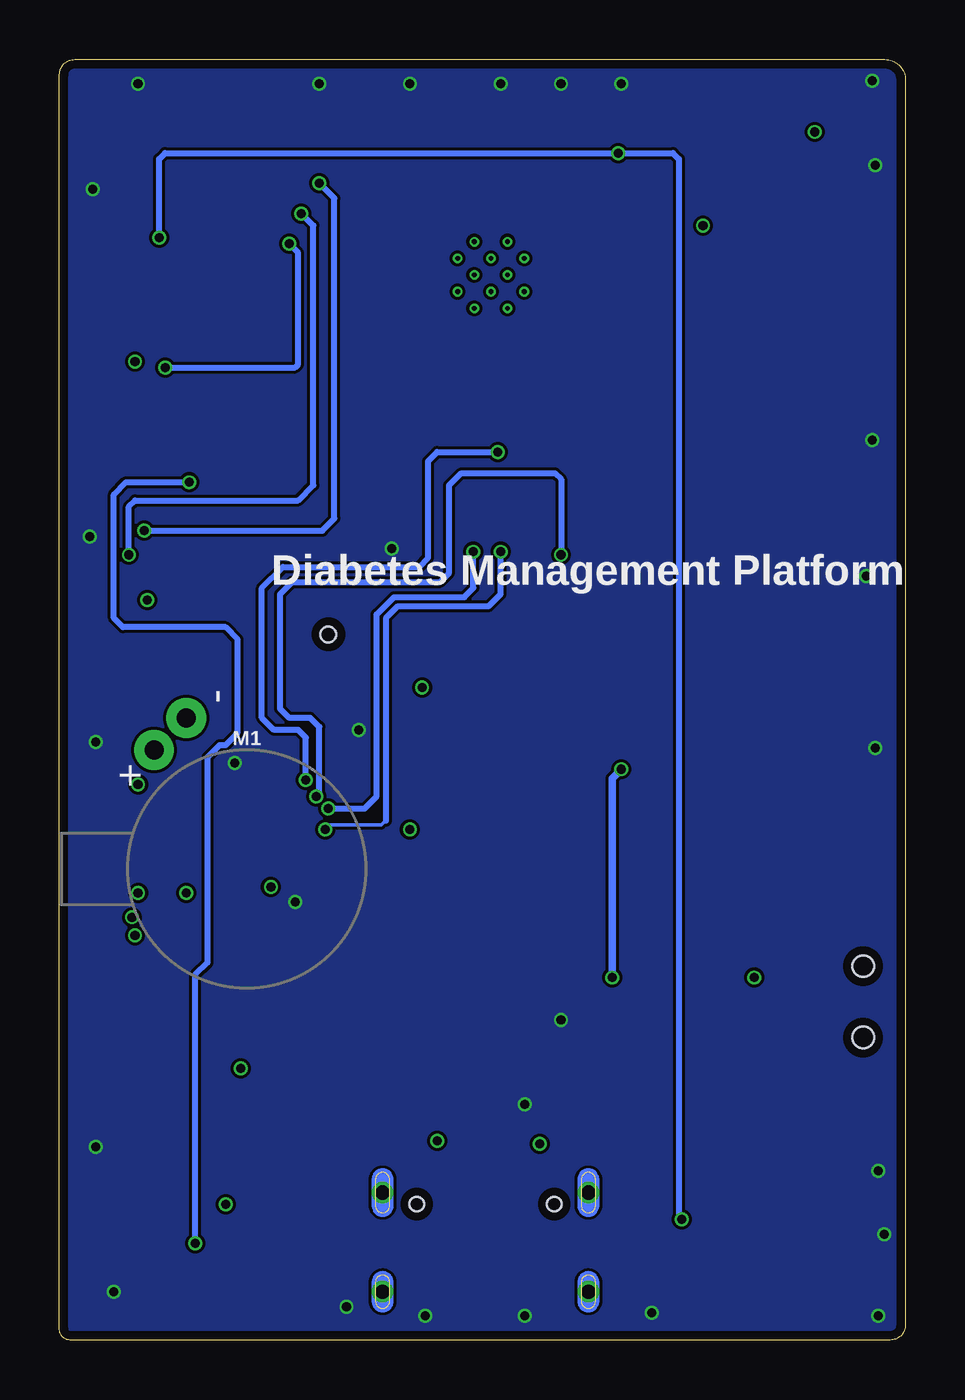
[diagram p6: board, bottom side, seen from below]

Size 35.56 x 53.85 mm. Coordinates in mm from the lower left corner, seen from the top.
Outline: 34.92,53.85 0.87,53.85 arc90 0,52.98 0,0.64 arc90 0.64,0 35.13,0 arc90 35.56,0.43 35.56,53.21 arc90 34.92,53.85
Copper layers (1*2*15*16): Top 0.035559375mm / dielectric 0.17018125mm / Route2 0.01778125mm / dielectric 47mil / Route15 0.01778125mm / dielectric 0.17018125mm / Bottom 0.035559375mm
Design rules "oshpark-4layer": minimum track width 5mil, minimum drill 10mil, track to track 5mil, track to pad 5mil, pad to pad 5mil, via to via 5mil, smd to smd 5mil, copper to edge 15mil, drill to drill 6mil, minimum pad ring 4mil, minimum via ring 4mil, stop-mask expansion 1.5mil, vias tented up to drill 0mil, thermal gap 10mil

### Footprints (pad centres in the part's own frame; a part is rotated, then mirrored left to right if it is on the bottom)
TACTILE_SWITCH_SMD_4.6X2.8MM = smd 0.9 x 1: 1 -2.05,-0.8; 2 2.05,-0.8; 3 2.05,0.8; 4 -2.05,0.8
0402 = smd 0.85 x 0.9: 1 -0.58,0; 2 0.58,0
CAPC1005X71N = smd 0.62 x 0.67: 1 -0.425,0; 2 0.425,0
C0402 = smd 0.5 x 0.5: 1 0,0.463; 2 0,-0.463
SOD-123 = smd 1.397 x 1.397: + -1.651,0; - 1.651,0
LED-0402 = smd 0.5 x 0.5: + -0.463,0; - 0.463,0
QFN50P300X450X100-16N = smd 0.675 x 0.25: 1 1.265,1.499; 2 1.265,0.999; 3 1.265,0.499; 4 1.265,-0.001; 5 1.265,-0.501; 6 1.265,-1.001; 7 1.265,-1.501; 9 -1.262,-1.5; 10 -1.262,-1; 11 -1.262,-0.5; 12 -1.262,0; 13 -1.262,0.5; 14 -1.262,1; 15 -1.262,1.5 | smd 0.25 x 0.675: 8 0,-2.012; 16 0,2.013
SAMTECH_FTSH-105-01 = smd 0.508 x 1.27: 1 -2.54,-2.413; 2 -2.54,2.413; 3 -1.27,-2.413; 4 -1.27,2.413; 5 0,-2.413; 6 0,2.413; 7 1.27,-2.413; 8 1.27,2.413; 9 2.54,-2.413; 10 2.54,2.413
MOLEX_53261-0471 = smd 0.8 x 1.6: 1 -1.875,0; 2 -0.625,0; 3 0.625,0; 4 1.875,0 | smd 2.1 x 3: SH1 -4.425,-2.9; SH2 4.425,-2.9
1X04_1MM_RA = smd 0.6 x 1.35: 1 -1.5,0; 2 -0.5,0; 3 0.5,0; 4 1.5,0 | smd 1.2 x 2: NC1 2.8,-3.675; NC2 -2.8,-3.675
HRO_TYPE-C-31-M-12 = smd 0.6 x 1.14: A1_B12 -3.2,4.75; A4_B9 -2.4,4.75; B1_A12 3.2,4.75; B4_A9 2.4,4.75 | smd 0.3 x 1.14: A5 -1.25,4.75; A6 -0.25,4.75; A7 0.25,4.75; A8 1.25,4.75; B5 1.75,4.75; B6 0.75,4.75; B7 -0.75,4.75; B8 -1.75,4.75 | drill 0.6 pad 0.9: S1 -4.325,4.17; S2 4.325,4.17; S3 -4.325,0; S4 4.325,0 | hole 0.6: -2.89,3.68; 2.89,3.68
JST-2-SMD = smd 1 x 4.6: 1 -1,-3.7; 2 1,-3.7 | smd 1.6 x 3.4: NC1 -3.4,1.5; NC2 3.4,1.5
VIBE-MOTOR-10MM = drill 0.8 pad 1.676: + -5,-3.9; - -6.35,-2.54
MIC_ICS-41350 = smd 0.725 x 0.522: 1 -0.838,1.361; 2 -0.838,0.539; 4 0.838,0.539; 5 0.838,1.361 | smd 0.2 x 0.2: 3 -0.015,-1.383 | hole 0.65: 0,-0.713
SOT23-3 = smd 0.8 x 0.9: 1 -0.95,-1; 2 0.95,-1; 3 0,1.1
0603 = smd 1.1 x 1: 1 -0.85,0; 2 0.85,0
SW_PCM12SMTR = smd 0.7 x 1.5: 1 -2.25,1.75; 2 0.75,1.75; 3 2.25,1.75 | smd 1 x 0.8: S1 -3.65,0.965; S2 -3.65,-0.965; S3 3.65,-0.965; S4 3.65,0.965 | hole 0.9: -1.5,0; 1.5,0
XCVR_ESP32-S3-WROOM-1-N16R2 = smd 1.5 x 0.9: 1 -8.75,5.26; 2 -8.75,3.99; 3 -8.75,2.72; 4 -8.75,1.45; 5 -8.75,0.18; 6 -8.75,-1.09; 7 -8.75,-2.36; 8 -8.75,-3.63; 9 -8.75,-4.9; 10 -8.75,-6.17; 11 -8.75,-7.44; 12 -8.75,-8.71; 13 -8.75,-9.98; 14 -8.75,-11.25; 27 8.75,-11.25; 28 8.75,-9.98; 29 8.75,-8.71; 30 8.75,-7.44; 31 8.75,-6.17; 32 8.75,-4.9; 33 8.75,-3.63; 34 8.75,-2.36; 35 8.75,-1.09; 36 8.75,0.18; 37 8.75,1.45; 38 8.75,2.72; 39 8.75,3.99; 40 8.75,5.26 | smd 0.9 x 1.5: 15 -6.985,-12.5; 16 -5.715,-12.5; 17 -4.445,-12.5; 18 -3.175,-12.5; 19 -1.905,-12.5; 20 -0.635,-12.5; 21 0.635,-12.5; 22 1.905,-12.5; 23 3.175,-12.5; 24 4.445,-12.5; 25 5.715,-12.5; 26 6.985,-12.5 | smd 0.9 x 0.9: 41_1 -1.5,-2.46; 41_2 -2.9,-2.46; 41_3 -0.1,-2.46; 41_4 -2.9,-3.86; 41_5 -1.5,-3.86; 41_6 -0.1,-3.86; 41_7 -2.9,-1.06; 41_8 -1.5,-1.06; 41_9 -0.1,-1.06 | drill 0.2 pad 0.4: 41_10 -1.5,-1.76; 41_11 -2.9,-1.76; 41_12 -0.1,-1.76; 41_13 -2.9,-3.16; 41_14 -1.5,-3.16; 41_15 -0.1,-3.16; 41_16 -2.2,-1.06; 41_17 -0.8,-1.06; 41_18 -2.2,-2.46; 41_19 -0.8,-2.46; 41_20 -2.2,-3.86; 41_21 -0.8,-3.86
SOP50P490X110-10N = smd 1.47 x 0.28: 1 -2.15,1; 2 -2.15,0.5; 3 -2.15,0; 4 -2.15,-0.5; 5 -2.15,-1; 6 2.15,-1; 7 2.15,-0.5; 8 2.15,0; 9 2.15,0.5; 10 2.15,1
IC_BME688 = smd 0.4 x 0.4: 1 1.2,1.2; 2 1.2,0.4; 3 1.2,-0.4; 4 1.2,-1.2; 5 -1.2,-1.2; 6 -1.2,-0.4; 7 -1.2,0.4; 8 -1.2,1.2
SOT95P280X145-5N = smd 1.39 x 0.58: 1 -1.165,0.95; 2 -1.165,0; 3 -1.165,-0.95; 4 1.165,-0.95; 5 1.165,0.95
SOT95P280X145-5N' = smd 1.22 x 0.6: 1 -1.245,0.95; 2 -1.245,0; 3 -1.245,-0.95; 4 1.245,-0.95; 5 1.245,0.95
SOT95P280X145-6N = smd 1.21 x 0.59: 1 -1.255,0.95; 2 -1.255,0; 3 -1.255,-0.95; 4 1.255,-0.95; 5 1.255,0; 6 1.255,0.95
XTAL_FC-135_32.7680KA-A0 = smd 1 x 1.8: 1 -1.25,0; 2 1.25,0

### Placement (x,y rotation side)
BOOT  26.67,3.56 180 top
C1  6.1,49.15 270 top
C2  2.54,44.07 0 top
C3  2.54,41.53 0 top
C4  5.21,51.94 90 top
C5  6.6,52.2 90 top
C6  2.79,4.19 270 top
C7  32.64,22.48 270 top
C8  28.19,7.11 180 top
C9  29.34,22.73 180 top
C10  34.42,15.88 90 top
C11  31.75,15.88 270 top
C12  27.18,22.86 270 top
C13  21.97,21.84 270 top
C14  7.49,13.84 0 top
C15  7.62,16.13 0 top
C16  11.94,9.53 270 top
C17  7.75,9.53 270 top
C18  13.08,21.84 90 top
C19  13.59,15.62 180 top
C20  21.46,27.05 270 top
D1  5.97,11.81 90 top
D2  17.14,19.05 90 top
IC1  24.64,21.72 0 top
J1  32.13,43.56 90 top
J2  30.48,33.27 90 top
J3  30.48,7.62 90 top
J4  17.65,2.03 0 top
J5  3.68,24.13 90 top
L1  9.78,10.03 180 top
M1  27.69,19.81 270 bottom
MK1  24.26,28.96 180 top
Q1  12.45,24 0 top
R1  7.62,49.15 270 top
R2  7.37,42.93 90 top
R3  28.19,9.91 180 top
R4  28.19,8.51 180 top
R5  6.35,1.27 0 top
R6  26.54,1.02 180 top
R7  15.49,15.49 90 top
R8  16.13,22.73 0 top
R9  11.43,20.07 90 top
RESET  6.22,4.19 180 top
SW1  1.78,14.22 270 top
U1  18.92,47.24 0 top
U2  31.24,20.07 0 top
U3  32.64,13.21 270 top
U4  9.91,14.61 90 top
U5  MCP73831T-2ATI/OT  [SOT95P280X145-5N']  14.61,19.05 270 top
U6  19.05,12.7 270 top
Y1  5.33,42.8 90 top

### Tracks (layer width: path | path; a pad name or v marks a point on that pad's centre or on a via)
3.3V  (via drill 0.38)
  Top 0.254: IC1.11 22.02,21.22 C13.2 21.03,21.26 v20.83,21.46 | J1.1 32.51,41.02 v32.38,41.15 | J2.1 31.59,31.4 v31.88,31.11 | J3.2 28.78,7.12 C8.1 28.77,5.91 v28.57,5.71 | R4.2 R3.2 27.61,11.1 v27.94,11.43 | R1.2 7.62,47.75 v8.51,46.86 | MK1.5 21.5,27.59 C20.1 20.52,27.63 v20.32,27.43 | IC1.3 27.11,22.22 C12.2 27.18,20.45 | 27.18,20.45 26.92,20.19 25.93,20.19 IC1.7 | 27.18,20.45 27.18,19.56 v26.67,19.05 26.69,19.07 | U2.6 32.53,19.07 v32.26,18.8 | v32.38,17.02 32.21,16.85 C11.1 32.21,14.43 U3.6 32.24,13.35 33.04,12.55 U3.2 | U3.8 33.84,15.76 C10.1 33.95,17.35 33.53,17.78 v32.51,17.78 | U2.10 32.53,21.07 32.18,21.42 C7.2 32.18,23.29 v32.26,23.37 | U2.5 29.96,19.07 v30.23,18.8
  Top 0.305: U1.2 8.46,51.23 8.07,51.62 C5.1 5.31,51.62 C4.1 4.53,51.52 v3.81,50.8 | U4.5 8.85,15.67 C15.2 6.78,15.67 v6.35,15.24
  pour Route15: 2.54,2.54 2.54,52.07 33.02,52.07 33.02,3.92 arc-45 32.95,3.74 31.75,2.54
BOOT  (via drill 0.38)
  Top 0.254: BOOT.2 BOOT.1 29.55,4.36 v29.84,4.06 | v30.1,36.07 30.02,35.99 U1.27
  Bottom 0.254: v29.84,4.06 29.84,15.37 29.34,15.88 29.34,24.51 28.83,25.02 28.57,25.02 28.07,25.53 28.07,29.46 28.57,29.97 32.89,29.97 33.27,30.35 33.27,35.56 32.77,36.07 v30.1,36.07
EN  (via drill 0.38)
  Top 0.254: J1.10 31.11,46.1 v31.37,46.35 | v12.06,49.91 9.96,49.91 9.91,49.96 | v9.4,5.08 9.31,4.99 8,4.99
  Top 0.305: U1.3 9.91,49.96 9.07,49.96 8.84,49.73 R1.1 C1.1 | C6.1 3.01,4.99 RESET.2 8,4.99 RESET.1
  Bottom 0.254: v31.37,46.35 31.37,49.66 31.11,49.91 v12.06,49.91 9.78,49.91 9.53,49.66 9.53,5.21 v9.4,5.08
GND  (via drill 0.38)
  Top 0.254: MK1.3 24.13,30.48 24.13,31.75 | U1.41_1 17.42,44.84 16.97,45.3 16.97,45.67 17.42,46.13 U1.41_8
  other vias: 11.94,52.83 14.48,52.83 17.02,52.83 20.83,52.83 24.64,52.83 32.26,52.83 34.16,48.39 34.29,33.78 34.04,25.15 34.04,8.13 33.27,2.03 23.5,1.4 20.19,1.02 16,1.02 10.67,1.14 1.14,1.02 0.89,4.45 1.14,7.11 1.27,24.89 1.65,32.13 1.4,37.85 1.27,49.4 1.4,52.96 16,9.91 14.48,13.46 28.19,24.26 25.65,18.41 22.99,25.65 21.59,33.27
  pour Top: -5.08,-3.81 -5.08,51.96 arc-45 -5.01,52.14 -3.81,53.34 0.02,53.34 arc45 0.2,53.41 0.64,53.85 35.71,53.85 arc-45 35.89,53.77 36.45,53.21 36.45,0.99 arc-45 36.37,0.81 34.54,-1.02 -2.18,-1.02 arc45 -2.36,-1.09
  pour Bottom: -5.08,-2.54 -5.08,51.96 arc-45 -5.01,52.14 -3.81,53.34 0.02,53.34 arc45 0.2,53.41 0.64,53.85 35.71,53.85 arc-45 35.89,53.77 36.45,53.21 36.45,0.99 arc-45 36.37,0.81 34.54,-1.02 -2.18,-1.02 arc45 -2.36,-1.09 -5.08,-3.81
  pour Route2: -5.08,0 -5.08,48.03 arc-45 -5.01,48.21 0.51,53.72 35.84,53.72 arc-45 36.02,53.65 36.2,53.47 36.2,0.74 arc-45 36.12,0.56 34.54,-1.02 -2.31,-1.02 arc45 -2.49,-1.09 -5.08,-3.68 -5.08,-1.27
  pour Route15 (rank 2): -5.08,-2.54 -5.08,48.03 arc-45 -5.01,48.21 0.64,53.85 35.71,53.85 arc-45 35.89,53.77 36.32,53.34 36.32,0.99 arc-45 36.25,0.81 34.54,-0.89 -2.05,-0.89 arc45 -2.23,-0.96 -5.08,-3.81
INT1_ACCEL  (via drill 0.38)
  Top 0.254: IC1.16 24.64,22.99 v24.77,22.86 | v14.48,33.02 U1.17
  Bottom 0.254: v24.77,22.86 24.64,22.99 24.64,25.78 25.02,26.16 25.91,26.16 26.29,26.54 26.29,31.37 25.78,31.88 19.56,31.88 19.18,32.26 19.18,35.94 18.67,36.45 14.73,36.45 14.48,36.2 v14.48,33.02
INT1_GYRO  (via drill 0.38)
  Top 0.152: IC1.12 24.13,21.72 v24.38,21.46
  Top 0.254: v17.02,33.15 U1.19
  Bottom 0.152: v24.38,21.46 24.19,21.65 22.04,21.65 21.84,21.84
  Bottom 0.254: v17.02,33.15 17.02,31.37 17.53,30.86 21.34,30.86 21.84,30.35 21.84,21.84
INT2_ACCEL  (via drill 0.38)
  Top 0.254: IC1.1 25.54,23.22 v25.2,23.55 | v17.14,37.34 16.13,37.34 15.75,36.96 U1.18
  Bottom 0.254: v25.2,23.55 25.2,25.33 25.53,25.65 26.54,25.65 27.05,26.16 27.05,31.62 26.16,32.51 20.45,32.51 20.07,32.89 20.07,36.96 19.68,37.34 v17.14,37.34
INT2_GYRO  (via drill 0.38)
  Top 0.254: IC1.13 24.12,22.22 v24.26,22.35 | v18.16,33.15 18.16,34.62 U1.20
  Bottom 0.254: v24.26,22.35 22.73,22.35 22.23,22.86 22.23,30.51 21.49,31.24 18.54,31.24 18.16,31.62 v18.16,33.15
N$1
  Top 0.254: J4.A5 16.4,3.96 16.13,3.68 10.16,3.68 9.78,3.3 9.78,1.78 9.27,1.27 R5.2
N$2
  Top 0.254: R6.2 23.89,1.02 23.72,0.85 21.37,0.85 20.57,1.65 19.94,1.65 19.4,2.19 J4.B5
N$3
  Top 0.305: Q1.3 9.19,25.1 8.89,25.4 7.65,25.4 J5.2
N$6
  Top 0.254: U2.1 29.96,21.07 30.23,21.34 30.23,21.46 29.92,21.77 C9.1
N$10
  Top 0.254: U2.7 32,19.57 31.59,19.98 M1.+
N$11
  Top 0.254: U2.9 34.54,20.57 34.8,20.83 34.8,25.91 34.54,26.16 M1.-
N$12
  Top 0.305: D2.- 17.14,20.7 17.91,21.46 17.91,22.35 17.53,22.73 R8.2
N$13
  Top 0.305: U5.1 R8.1
N$14  (via drill 0.38)
  Top 0.305: J4.B4_A9 20.05,8.01 v19.68,8.38 | J4.A4_B9 15.25,8.14 v15.37,8.26 15.37,9.53 14.79,10.11 C16.1 11.87,10.03 L1.1
  Route15 0.305: v19.68,8.38 15.49,8.38 v15.37,8.26
N$15
  Top 0.305: R7.2 15.49,17.74 U5.5
PDM_CLK
  Top 0.254: MK1.4 22.38,28.42 22.23,28.57 22.23,31.62 22.61,32 22.86,32 23.37,32.51 U1.24
PDM_DATA
  Top 0.254: MK1.1 26.2,27.59 26.54,27.94 26.54,31.24 26.16,31.62 25.15,31.62 24.64,32.13 U1.25
RTC_N
  Top 0.305: U1.9 R2.1 7.37,41.91 6.99,41.53 5.35,41.53 Y1.1 5.31,41.53 C3.2
RTC_P
  Top 0.305: U1.8 10.06,43.51 R2.2 7.17,43.51 6.6,44.07 5.35,44.07 Y1.2 3.14,44.05 C2.2
RX  (via drill 0.38)
  Top 0.254: J2.2 32.27,32.65 v32.64,33.02 | v25.4,47.37 25.45,47.42 U1.36
  Bottom 0.254: v32.64,33.02 32.64,35.05 32.38,35.31 25.53,35.31 24.89,35.94 24.89,46.86 v25.4,47.37
SCL
  Top 0.254: R3.1 29.97,9.91 30.48,9.4 J3.4 31.34,9.12 31.5,9.27 31.5,11.18 31.37,11.3 31.37,11.94 U3.4 31.44,12.63 31.11,12.95 27.94,12.95 27.69,13.21 27.69,17.14 | U2.2 28.19,20.57 27.69,20.07 27.69,17.14 | 27.69,17.14 27.3,17.53 24.89,17.53 24.64,17.78 IC1.8 24.62,19.68 20.19,19.68 19.81,20.07 19.81,26.63 19.39,27.05 19.39,27.82 19.56,27.98 U1.21
SDA
  Top 0.254: R4.1 29.34,8.51 29.73,8.12 J3.3 31.74,8.12 32.24,8.62 U3.3 32.24,12.72 31.5,13.46 28.57,13.46 28.1,13.93 28.1,19.85 28.32,20.07 U2.3 30.48,20.07 30.86,20.45 30.86,23.75 29.72,24.89 20.57,24.89 20.19,25.27 | IC1.9 20.55,20.22 20.19,20.57 20.19,25.27 | U1.22 20.83,33.4 20.19,32.77 20.19,28.08 19.77,27.66 19.77,27.21 20.19,26.79 20.19,25.27
TCK
  Top 0.254: U1.32 27.73,42.29 J1.4
TDI
  Top 0.254: U1.34 27.73,44.83 J1.8
TDO
  Top 0.254: U1.33 27.73,43.56 J1.6
TMS  (via drill 0.38)
  Top 0.254: J1.2 30.99,41.02 v31.11,40.89 | v25.91,46.1 25.96,46.15 U1.35
  Bottom 0.254: v31.11,40.89 25.65,40.89 25.53,41.02 25.53,45.72 v25.91,46.1
TX  (via drill 0.38)
  Top 0.254: J2.3 31.87,33.9 v32,34.04 | v24.64,48.64 27.62,48.64 U1.37
  Bottom 0.254: v32,34.04 24.51,34.04 24,34.54 24,48.01 v24.64,48.64
USB_N
  Top 0.152: U6.3 18.1,14.87 18.91,15.68 18.91,26.56 18.29,27.18 7.61,27.18 7.09,27.7 7.09,36.06 8.29,37.26 U1.13
USB_P
  Top 0.152: U6.1 20,14.87 19.19,15.68 19.19,26.67 18.4,27.46 7.72,27.46 7.37,27.81 7.37,35.18 8.18,35.99 U1.14
USBD_N
  Top 0.152: J4.A7 17.9,7.66 18.01,7.77 18.01,8.87 | U6.4 18.1,10.73 18.8,10.03 18.8,9.67 18.01,8.88 18.01,8.87 | J4.B7 16.9,7.76 18.01,8.87
USBD_P
  Top 0.152: U6.6 20,10.96 19.07,10.03 19.07,9.55 18.29,8.77 18.29,7.77 18.4,7.66 J4.B6 18.41,6.77 18.41,5.84 18.03,5.46 17.78,5.46 17.4,5.84 J4.A6
V_BATT
  Top 0.305: Q1.2 13.54,22.86 C18.2 13.65,21.73 U5.3 13.65,19.35 13.22,18.91 13.22,18.68 12.06,17.53 6.48,17.53 6.1,17.14 6.1,16.76 5.81,16.47 SW1.1
V_USB  (via drill 0.38)
  Top 0.305: D1.+ 6.02,10.11 C17.1 7.82,10.03 L1.2 9.2,10.98 9.65,11.43 10.79,11.43 10.92,11.3 11.81,11.3 12.32,11.81 | R9.2 11.43,22.94 | 11.43,22.94 Q1.1 | 12.32,11.81 v12.32,15.24 12.32,15.75 12.65,16.08 C19.2 13.59,17.74 U5.4 13.65,18.73 13.97,19.05 16,19.05 16.46,18.59 D2.+ 17.14,13.08 | U6.5 19.05,12.45 18.8,12.7 17.53,12.7 17.14,13.08 | 17.14,13.08 17.14,12.95 16.51,12.32 12.83,12.32 12.32,11.81 | v11.94,24 11.81,24 11.43,23.62 11.43,22.94
  Bottom 0.305: v12.32,15.24 12.32,23.62 v11.94,24
VIN
  Top 0.305: SW1.2 5.96,13.47 D1.- 7.41,13.46 C14.2 8.9,13.38 U4.1 8.96,14.16 9.27,14.48 10.67,14.48 10.86,14.29 U4.3

### Text on the board
tPlace: DMP
bPlace: Diabetes Management Platform